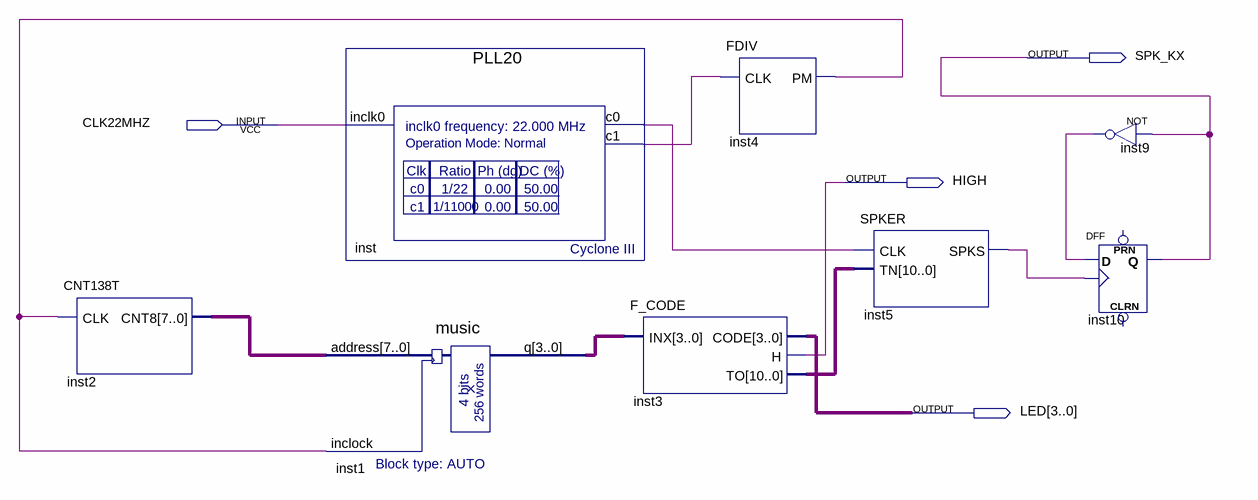
[diagram p0: schematic sheet]
// Quartus schematic yuequyanzou.bdf as structural Verilog: 8 symbols, 4 pins
module yuequyanzou (
  input  CLK22MHZ,
  output SPK_KX,
  output HIGH,
  output [3:0] LED
);

  wire inst4_pm, inst5_spks, inst9_out, inst_c0, inst_c1;
  wire [3:0] inst1_q;
  wire [7:0] inst2_cnt8;
  wire [10:0] inst3_to;

  CNT138T inst2 (.CLK(inst4_pm), .CNT8(inst2_cnt8));
  PLL20 inst (.inclk0(CLK22MHZ), .c0(inst_c0), .c1(inst_c1));
  music inst1 (.address(inst2_cnt8), .inclock(inst4_pm), .q(inst1_q));
  F_CODE inst3 (.INX(inst1_q), .CODE(LED), .H(HIGH), .TO(inst3_to));
  FDIV inst4 (.CLK(inst_c1), .PM(inst4_pm));
  SPKER inst5 (.CLK(inst_c0), .TN(inst3_to), .SPKS(inst5_spks));
  not inst9 (inst9_out, SPK_KX);
  DFF inst10 (.CLK(inst5_spks), .D(inst9_out), .Q(SPK_KX));  // open: CLRN, PRN
endmodule
